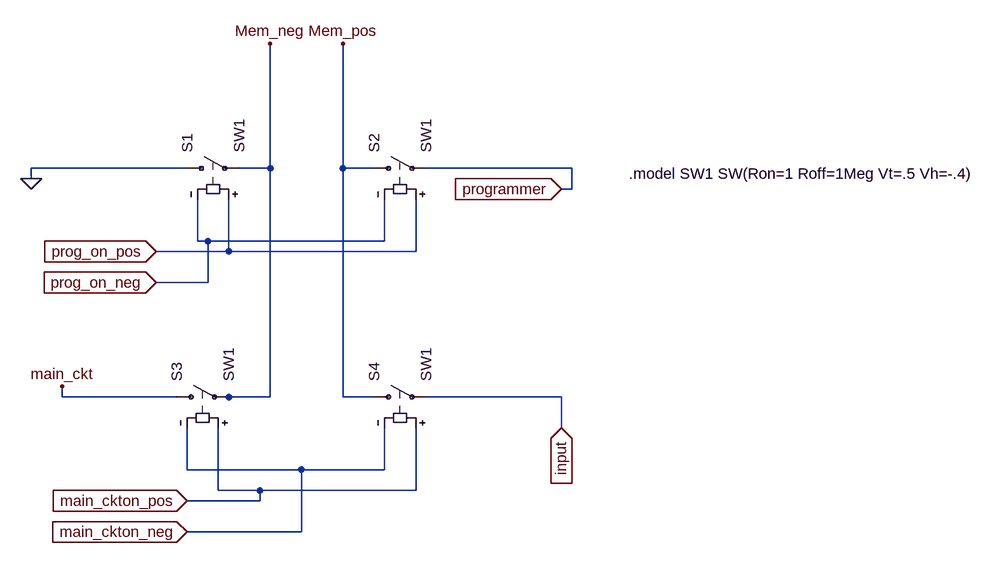
[diagram p0: schematic switch_block.asc]
switch_block.asc, the LTspice schematic file:
Version 4
SHEET 1 1300 744
WIRE 0 112 -240 112
WIRE 128 112 128 -80
WIRE 128 112 80 112
WIRE 240 112 240 -80
WIRE 288 112 240 112
WIRE 592 112 368 112
WIRE -240 128 -240 112
WIRE 592 144 592 112
WIRE 592 144 576 144
WIRE 16 224 16 160
WIRE 32 224 16 224
WIRE 304 224 304 160
WIRE 304 224 32 224
WIRE 64 240 64 160
WIRE 64 240 -48 240
WIRE 352 240 352 160
WIRE 352 240 64 240
WIRE 32 288 32 224
WIRE 32 288 -48 288
WIRE -192 464 -192 448
WIRE -16 464 -192 464
WIRE 64 464 48 464
WIRE 128 464 128 112
WIRE 128 464 64 464
WIRE 240 464 240 112
WIRE 288 464 240 464
WIRE 576 464 368 464
WIRE 576 512 576 464
WIRE 0 576 0 512
WIRE 176 576 0 576
WIRE 304 576 304 512
WIRE 304 576 176 576
WIRE 48 608 48 512
WIRE 112 608 48 608
WIRE 352 608 352 512
WIRE 352 608 112 608
WIRE 112 624 112 608
WIRE 112 624 0 624
WIRE 176 672 176 576
WIRE 176 672 0 672
FLAG -240 128 0
FLAG 576 512 input
IOPIN 576 512 In
FLAG 576 144 programmer
IOPIN 576 144 In
FLAG -192 448 main_ckt
FLAG 128 -80 Mem_neg
FLAG 240 -80 Mem_pos
FLAG -48 240 prog_on_pos
IOPIN -48 240 In
FLAG -48 288 prog_on_neg
IOPIN -48 288 In
FLAG 0 624 main_ckton_pos
IOPIN 0 624 In
FLAG 0 672 main_ckton_neg
IOPIN 0 672 In
SYMBOL sw -16 112 R270
SYMATTR InstName S1
SYMATTR Value SW1
SYMBOL sw 272 112 R270
SYMATTR InstName S2
SYMATTR Value SW1
SYMBOL sw -32 464 R270
SYMATTR InstName S3
SYMATTR Value SW1
SYMBOL sw 272 464 R270
SYMATTR InstName S4
SYMATTR Value SW1
TEXT 680 120 Left 2 !.model SW1 SW(Ron=1 Roff=1Meg Vt=.5 Vh=-.4)

The netlist it stands for:
* switch_block.asc
S1 0 Mem_neg prog_on_pos prog_on_neg SW1
S2 Mem_pos programmer prog_on_pos prog_on_neg SW1
S3 main_ckt Mem_neg main_ckton_pos main_ckton_neg SW1
S4 Mem_pos input main_ckton_pos main_ckton_neg SW1
.model SW1 SW(Ron=1 Roff=1Meg Vt=.5 Vh=-.4)
.backanno
.end